# Altium schematic sheet Server PIMC.schdoc
size 537 x 318 mm
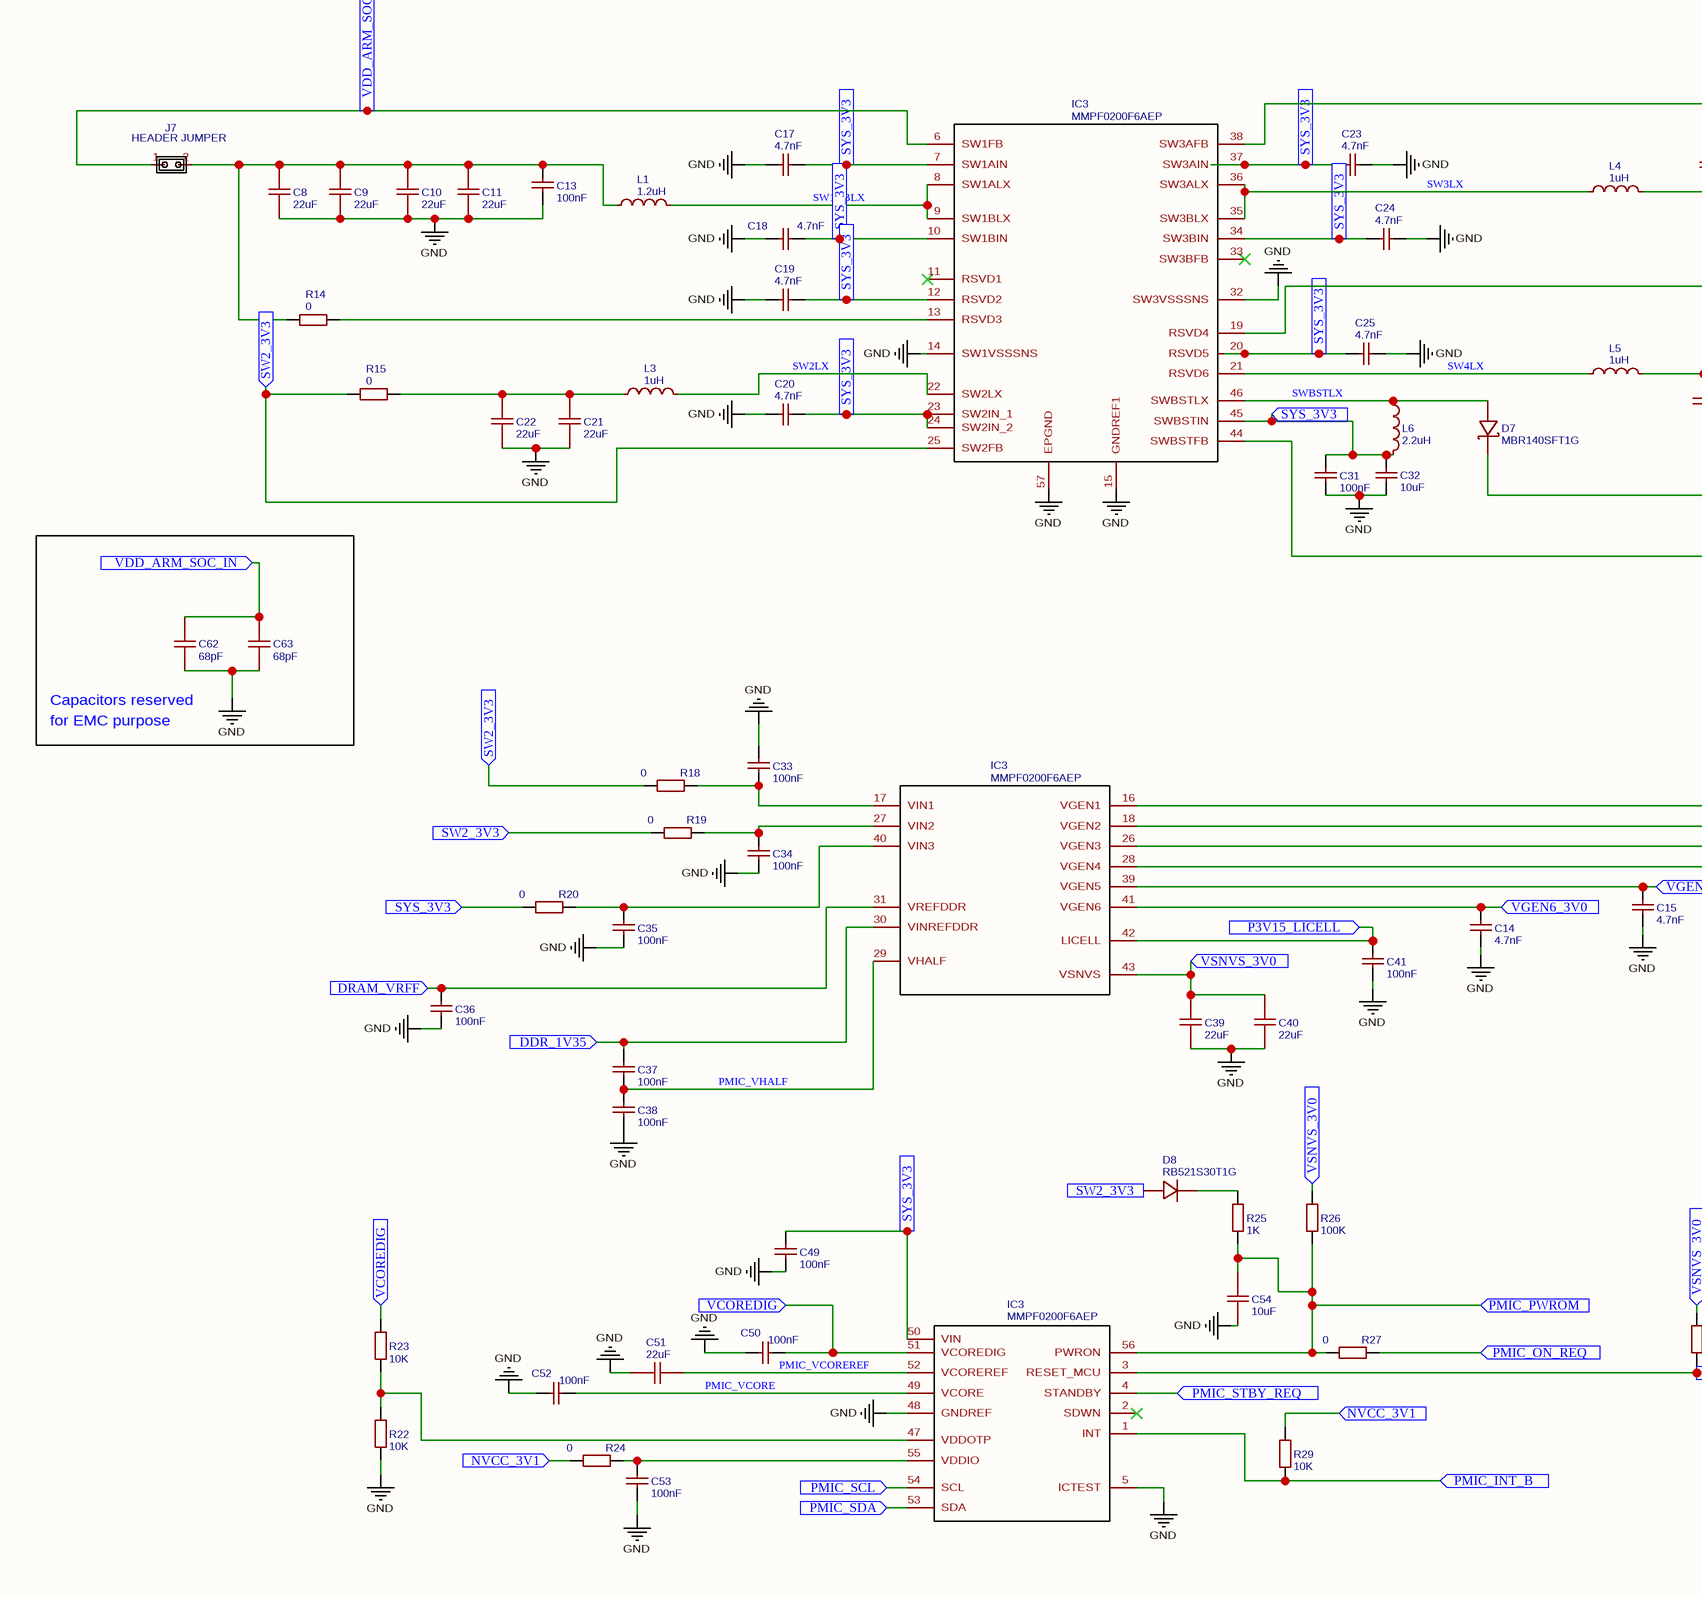
[diagram p0: Server PIMC.schdoc, left]
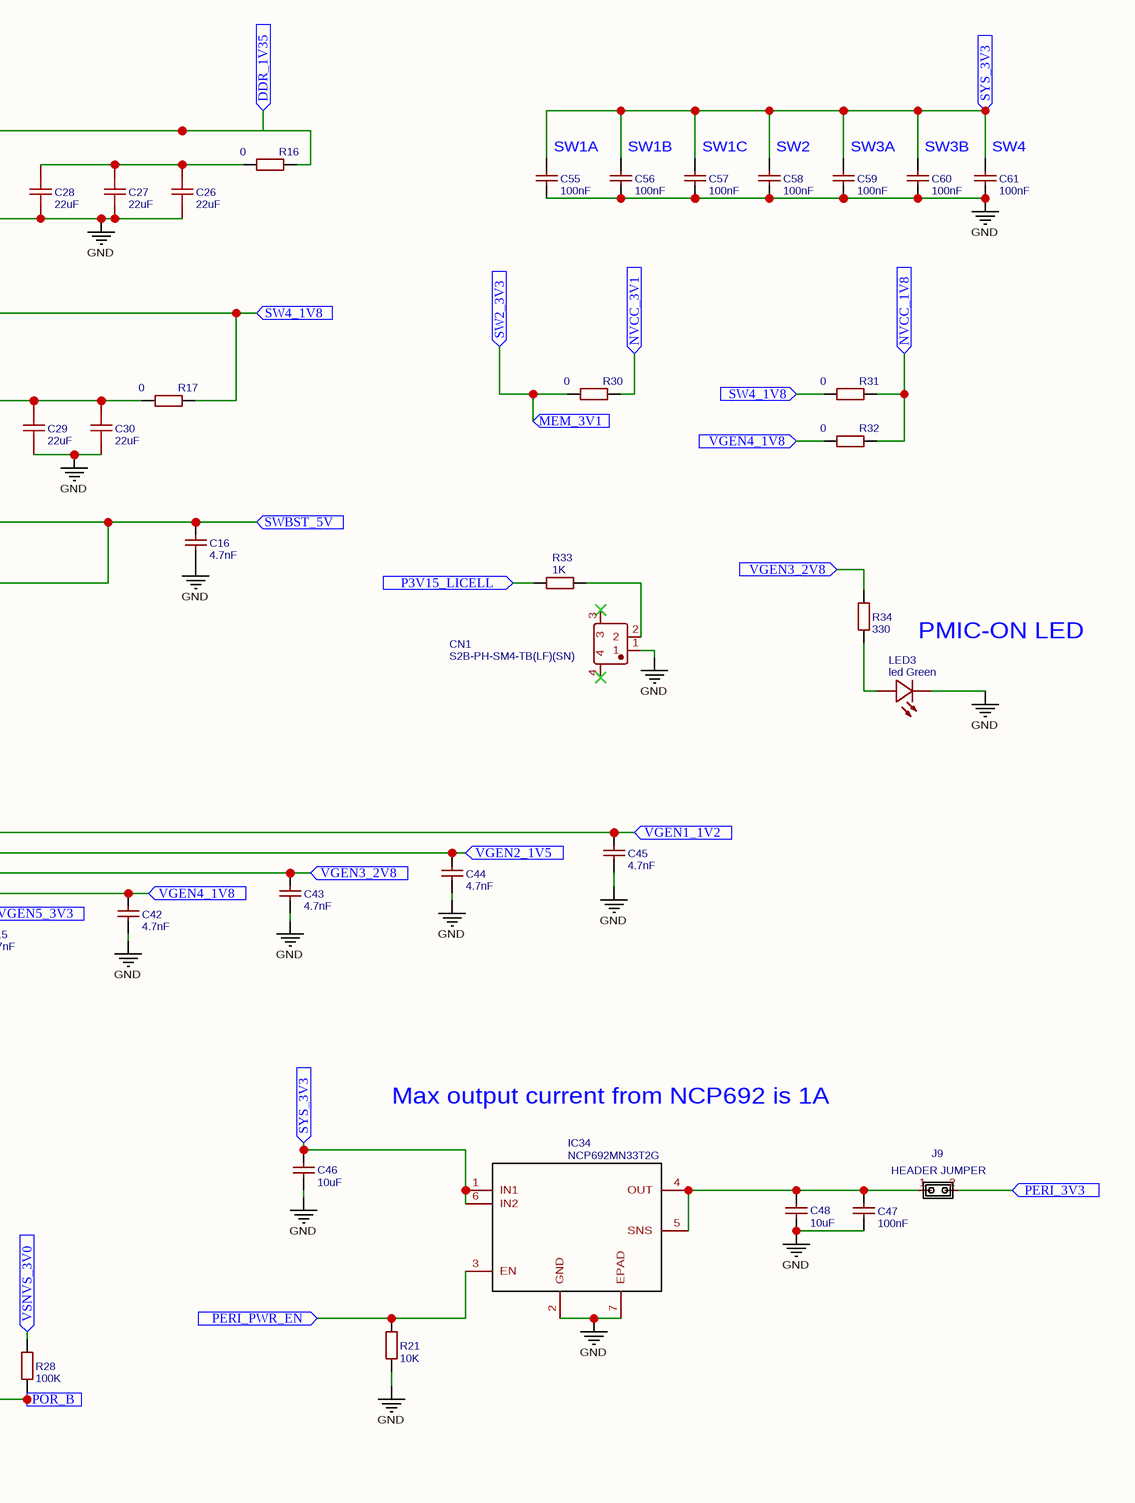
[diagram p1: Server PIMC.schdoc, right]

## Parts
(Parts that share a designator on the sheet are numbered #1, #2 ... from top to bottom, then left to right.)
C8  22uF  [C0603]
C9  22uF  [C0603]
C10  22uF  [C0603]
C11  22uF  [C0603]
C13  100nF  [C0805]
C14  4.7nF  [C0805]
C15  4.7nF  [C0805]
C16  4.7nF  [C0805]
C17  4.7nF  [C0805]
C18  4.7nF  [C0805]
C19  4.7nF  [C0805]
C20  4.7nF  [C0805]
C21  22uF  [C0603]
C22  22uF  [C0603]
C23  4.7nF  [C0805]
C24  4.7nF  [C0805]
C25  4.7nF  [C0805]
C26  22uF  [C0603]
C27  22uF  [C0603]
C28  22uF  [C0603]
C29  22uF  [C0603]
C30  22uF  [C0603]
C31  100nF  [C0805]
C32  10uF  [C0402]
C33  100nF  [C0805]
C34  100nF  [C0805]
C35  100nF  [C0805]
C36  100nF  [C0805]
C37  100nF  [C0805]
C38  100nF  [C0805]
C39  22uF  [C0603]
C40  22uF  [C0603]
C41  100nF  [C0805]
C42  4.7nF  [C0805]
C43  4.7nF  [C0805]
C44  4.7nF  [C0805]
C45  4.7nF  [C0805]
C46  10uF  [C0402]
C47  100nF  [C0805]
C48  10uF  [C0402]
C49  100nF  [C0805]
C50  100nF  [C0805]
C51  22uF  [C0603]
C52  100nF  [C0805]
C53  100nF  [C0805]
C54  10uF  [C0805]
C55  100nF  [C0805]
C56  100nF  [C0805]
C57  100nF  [C0805]
C58  100nF  [C0805]
C59  100nF  [C0805]
C60  100nF  [C0805]
C61  100nF  [C0805]
C62  68pF  [C0402]
C63  68pF  [C0402]
CN1  S2B-PH-SM4-TB(LF)(SN)  [CONN-SMD_P2.00_S2B-PH-SM4-TB(LF)(SN)]
D7  MBR140SFT1G  [SOD-123F_L2.8-W1.8-LS3.7-RD]
D8  RB521S30T1G  [SOD-523_L1.2-W0.8-LS1.6-RD]
IC3#1  MMPF0200F6AEP  [QFN50P800X800X100-57N]
IC3#2  MMPF0200F6AEP  [QFN50P800X800X100-57N]
IC3#3  MMPF0200F6AEP  [QFN50P800X800X100-57N]
IC34  NCP692MN33T2G  [SON95P300X300X100-7N]
J7  HEADER JUMPER  [HDR1X2]
J9  HEADER JUMPER  [HDR1X2]
L1  1.2uH  [IND-SMD_L4.4-W4.2]
L3  1uH  [IND-SMD_L11.5-W10.5_MWSA1004]
L4  1uH  [IND-SMD_L11.5-W10.5_MWSA1004]
L5  1uH  [IND-SMD_L11.5-W10.5_MWSA1004]
L6  2.2uH  [L0805]
LED3  led Green  [LED1206-RD]
R14  0  [R0402]
R15  0  [R0402]
R16  0  [R0402]
R17  0  [R0402]
R18  0  [R0402]
R19  0  [R0402]
R20  0  [R0402]
R21  10K  [R0805]
R22  10K  [R0805]
R23  10K  [R0805]
R24  0  [R0402]
R25  1K  [R0603]
R26  100K  [R0603]
R27  0  [R0402]
R28  100K  [R0603]
R29  10K  [R0805]
R30  0  [R0402]
R31  0  [R0402]
R32  0  [R0402]
R33  1K  [R0402]
R34  330  [R0805]

## Ports
DDR_1V35 (in), DRAM_VRFF (in), MEM_3V1 (in), NVCC_1V8 (in), NVCC_3V1 (in), P3V15_LICELL (in), PERI_3V3 (in), PERI_PWR_EN (in), PMIC_INT_B (in), PMIC_ON_REQ (in), PMIC_PWROM (in), PMIC_SCL (in), PMIC_SDA (in), PMIC_STBY_REQ (in), POR_B (in), SW2_3V3 (in), SW4_1V8 (in), SWBST_5V (in), SYS_3V3 (in), VCOREDIG (in), VDD_ARM_SOC_IN (in), VGEN1_1V2 (in), VGEN2_1V5 (in), VGEN3_2V8 (in), VGEN4_1V8 (in), VGEN5_3V3 (in), VGEN6_3V0 (in), VSNVS_3V0 (in)

## Nets
GND: C8.1 C9.1 C10.1 C11.1 C13.1 C14.1 C15.1 C16.1 C17.2 C18.2 C19.2 C20.2 C21.1 C22.1 C23.2 C24.2 C25.2 C26.1 C27.1 C28.1 C29.1 C30.1 C31.1 C32.1 C33.2 C34.1 C35.1 C36.1 C38.1 C39.1 C40.1 C41.1 C42.1 C43.1 C44.1 C45.1 C46.1 C47.1 C48.1 C49.1 C50.2 C51.2 C52.2 C53.2 C54.1 C55.1 C56.1 C57.1 C58.1 C59.1 C60.1 C61.1 C62.1 C63.1 CN1.1 IC3#1.14(SW1VSSSNS) IC3#1.15(GNDREF1) IC3#1.32(SW3VSSSNS) IC3#1.57(EPGND) IC3#3.5(ICTEST) IC3#3.48(GNDREF) IC34.2(GND) IC34.7(EPAD) L4.2 LED3.1(-) R21.1 R22.2
DDR_1V35: C37.2 IC3#1.38(SW3AFB) IC3#2.30(VINREFDDR) R16.2 ; port DDR_1V35
DRAM_VRFF: C36.2 IC3#2.31(VREFDDR) ; port DRAM_VRFF
MEM_3V1: D8.2(A) IC3#1.25(SW2FB) R15.1 R18.1 R19.1 R30.1 ; port SW2_3V3, port MEM_3V1
NVCC_1V8: R31.2 R32.2 ; port NVCC_1V8
NVCC_3V1: R24.1 R29.1 R30.2 ; port NVCC_3V1
P3V15_LICELL: C41.2 IC3#2.42(LICELL) R33.1 ; port P3V15_LICELL
PERI_3V3: J9.2 ; port PERI_3V3
PERI_PWR_EN: IC34.3(EN) R21.2 ; port PERI_PWR_EN
PMIC_INT_B: IC3#3.1(INT) R29.2 ; port PMIC_INT_B
PMIC_ON_REQ: R27.2 ; port PMIC_ON_REQ
PMIC_PWROM: C54.2 IC3#3.56(PWRON) R25.1 R26.1 R27.1 ; port PMIC_PWROM
PMIC_SCL: IC3#3.54(SCL) ; port PMIC_SCL
PMIC_SDA: IC3#3.53(SDA) ; port PMIC_SDA
PMIC_STBY_REQ: IC3#3.4(STANDBY) ; port PMIC_STBY_REQ
PMIC_VCORE: C52.1 IC3#3.49(VCORE)
PMIC_VCOREREF: C51.1 IC3#3.52(VCOREREF)
PMIC_VHALF: C37.1 C38.2 IC3#2.29(VHALF)
POR_B: IC3#3.3(RESET_MCU) R28.1 ; port POR_B
SW1ABLX: IC3#1.8(SW1ALX) IC3#1.9(SW1BLX) L1.2
SW2LX: IC3#1.22(SW2LX) L3.2
SW3LX: IC3#1.35(SW3BLX) IC3#1.36(SW3ALX) L4.1
SW4_1V8: IC3#1.19(RSVD4) R17.2 R31.1 ; port SW4_1V8
SW4LX: IC3#1.21(RSVD6) L5.1
SWBST_5V: C16.2 D7.1(K) IC3#1.44(SWBSTFB) ; port SWBST_5V
SWBSTLX: D7.2(A) IC3#1.46(SWBSTLX) L6.1
SYS_3V3: C17.1 C18.1 C19.1 C20.1 C23.1 C24.1 C25.1 C31.2 C32.2 C46.2 C49.2 C55.2 C56.2 C57.2 C58.2 C59.2 C60.2 C61.2 IC3#1.7(SW1AIN) IC3#1.10(SW1BIN) IC3#1.12(RSVD2) IC3#1.20(RSVD5) IC3#1.23(SW2IN_1) IC3#1.24(SW2IN_2) IC3#1.34(SW3BIN) IC3#1.37(SW3AIN) IC3#1.45(SWBSTIN) IC3#3.50(VIN) IC34.1(IN1) IC34.6(IN2) L6.2 R20.1 ; port SYS_3V3
VCOREDIG: C50.1 IC3#3.51(VCOREDIG) R23.2 ; port VCOREDIG
VDD_ARM_SOC_IN: C62.2 C63.2 IC3#1.6(SW1FB) J7.1 ; port VDD_ARM_SOC_IN
VGEN1_1V2: C45.2 IC3#2.16(VGEN1) ; port VGEN1_1V2
VGEN2_1V5: C44.2 IC3#2.18(VGEN2) ; port VGEN2_1V5
VGEN3_2V8: C43.2 IC3#2.26(VGEN3) R34.2 ; port VGEN3_2V8
VGEN4_1V8: C42.2 IC3#2.28(VGEN4) R32.1 ; port VGEN4_1V8
VGEN5_3V3: C15.2 IC3#2.39(VGEN5) ; port VGEN5_3V3
VGEN6_3V0: C14.2 IC3#2.41(VGEN6) ; port VGEN6_3V0
VSNVS_3V0: C39.2 C40.2 IC3#2.43(VSNVS) R26.2 R28.2 ; port VSNVS_3V0
NetC8_2: C8.2 C9.2 C10.2 C11.2 C13.2 J7.2 L1.1 R14.1
NetC21_2: C21.2 C22.2 L3.1 R15.2
NetC26_2: C26.2 C27.2 C28.2 R16.1
NetC29_2: C29.2 C30.2 L5.2 R17.1
NetC33_1: C33.1 IC3#2.17(VIN1) R18.2
NetC34_2: C34.2 IC3#2.27(VIN2) R19.2
NetC35_2: C35.2 IC3#2.40(VIN3) R20.2
NetC47_2: C47.2 C48.2 IC34.4(OUT) IC34.5(SNS) J9.1
NetC53_1: C53.1 IC3#3.55(VDDIO) R24.2
NetCN1_2: CN1.2 R33.2
NetD8_1: D8.1(C) R25.2
NetIC3#1_13: IC3#1.13(RSVD3) R14.2
NetIC3#3_47: IC3#3.47(VDDOTP) R22.1 R23.1
NetLED3_2: LED3.2(+) R34.1

Not connected (* = marked no-connect by the designer): CN1 3* 4*; IC3#1 11(RSVD1)* 33(SW3BFB)*; IC3#3 2(SDWN)*

## Notes on the sheet
- (near C55) SW1A
- (near C56) SW1B
- (near C57) SW1C
- (near C58) SW2
- (near C59) SW3A
- (near C60) SW3B
- (near C61) SW4
- PMIC-ON LED
- (near C62) Capacitors reserved
- for EMC purpose
- Max output current from NCP692 is 1A

## Library data of the parts
C8-C11 C21 C22 C26-C30 C39 C40 C51 = 22uF: BOM_Manufacturer: SAMSUNG; BOM_Manufacturer Part: CL10A226MP8NUNE; nameAlias: Capacitance; SMT Type: Extend; BOM_Supplier: LCSC; BOM_Supplier Part: C86295; BOM_LCSC Assembly: Yes; spicePre: C; spiceSymbolName: CL10A226MP8NUNE
C13 C31 C33-C38 C41 C47 C49 C50 C52 C53 C55-C61 = 100nF: BOM_Manufacturer Part: CC0805KRX7R9BB104; BOM_Manufacturer: YAGEO; nameAlias: Capacitance; SMT Type: Basic; BOM_Supplier: LCSC; BOM_LCSC Assembly: Yes; BOM_Supplier Part: C49678; spicePre: C; spiceSymbolName: CC0805KRX7R9BB104
C14-C20 C23-C25 C42-C45 = 4.7nF: BOM_Manufacturer: FH; BOM_Manufacturer Part: 0805B472K500NT; nameAlias: Capacitance; SMT Type: Basic; BOM_Supplier: LCSC; BOM_LCSC Assembly: Yes; BOM_Supplier Part: C1744; spicePre: C; spiceSymbolName: 0805B472K500NT
C32 C46 C48 = 10uF: BOM_Manufacturer Part: CL05A106MQ5NUNC; BOM_Manufacturer: SAMSUNG; nameAlias: Capacitance; SMT Type: Basic; BOM_Supplier: LCSC; BOM_LCSC Assembly: Yes; BOM_Supplier Part: C15525; spicePre: C; spiceSymbolName: CL05A106MQ5NUNC
C54 = 10uF: BOM_Manufacturer: FH; BOM_Manufacturer Part: 0805F106M160NT; nameAlias: Capacitance; SMT Type: Extend; BOM_Supplier: LCSC; BOM_Supplier Part: C90545; BOM_LCSC Assembly: Yes; spicePre: C; spiceSymbolName: 0805F106M160NT
C62 C63 = 68pF: BOM_Manufacturer: SAMSUNG; BOM_Manufacturer Part: CL05C680JB5NNNC; nameAlias: Capacitance; SMT Type: Basic; BOM_Supplier: LCSC; BOM_LCSC Assembly: Yes; BOM_Supplier Part: C14441; spicePre: C; spiceSymbolName: CL05C680JB5NNNC
CN1 = S2B-PH-SM4-TB(LF)(SN): BOM_Manufacturer: JST Sales America; Contributor: LCSC; BOM_Supplier: LCSC; BOM_Supplier Part: C295747; BOM_Manufacturer Part: S2B-PH-SM4-TB(LF)(SN); spicePre: C; spiceSymbolName: S2B-PH-SM4-TB(LF)(SN)
D7 = MBR140SFT1G: BOM_Manufacturer: ON; Contributor: LCSC; SMT Type: Extend; BOM_Supplier: LCSC; BOM_Manufacturer Part: MBR140SFT1G; BOM_Supplier Part: C43381; BOM_LCSC Assembly: Yes; spicePre: D; spiceSymbolName: MBR140SFT1G
D8 = RB521S30T1G: BOM_Manufacturer: ON Semicon; Contributor: LCSC; SMT Type: Extend; BOM_Supplier: LCSC; BOM_Supplier Part: C145179; BOM_Manufacturer Part: RB521S30T1G; BOM_LCSC Assembly: Yes; spicePre: D; spiceSymbolName: RB521S30T1G
IC3#1-IC3#3 = MMPF0200F6AEP: subpart_no: 1; Contributor: Ke'Ondrae_Mell; spicePre: I; spiceSymbolName: MMPF0200F6AEP
IC34 = NCP692MN33T2G: Contributor: Ke'Ondrae_Mell; spicePre: I; spiceSymbolName: NCP692MN33T2G
J7 J9 = HEADER JUMPER: Contributor: iinnovations; sourceId: 5aKIigQpn; timeStamp: 1467472897; spicePre: J; spiceSymbolName: HEADER JUMPER
L1 = 1.2uH: BOM_Manufacturer: Sunlord; BOM_Manufacturer Part: MWSA0402S-1R2MT; nameAlias: Inductance; Contributor: LCSC; SMT Type: Extend; BOM_Supplier: LCSC; BOM_Supplier Part: C408333; BOM_LCSC Assembly: Yes; spicePre: L; spiceSymbolName: MWSA0402S-1R2MT
L3-L5 = 1uH: BOM_Manufacturer: Sunlord; BOM_Manufacturer Part: MWSA1004-1R0MT; nameAlias: Inductance; Contributor: LCSC; SMT Type: Extend; BOM_Supplier: LCSC; BOM_Supplier Part: C151871; BOM_LCSC Assembly: Yes; spicePre: L; spiceSymbolName: MWSA1004-1R0MT
L6 = 2.2uH: BOM_Manufacturer Part: CMI201209U2R2KT; BOM_Manufacturer: FH; nameAlias: Inductance; SMT Type: Basic; BOM_Supplier: LCSC; BOM_LCSC Assembly: Yes; BOM_Supplier Part: C1043; spicePre: L; spiceSymbolName: CMI201209U2R2KT
LED3 = led Green: BOM_Manufacturer: KENTO; SMT Type: Extend; BOM_Supplier: LCSC; BOM_Manufacturer Part: led Green; image: //image.lceda.cn/szlcsc/C14641.jpg; BOM_Supplier Part: C14641; BOM_LCSC Assembly: Yes; spicePre: L; spiceSymbolName: led Green
R14-R20 R24 R27 R30-R32 = 0: BOM_Manufacturer: KOA; BOM_Manufacturer Part: RK73Z1ETTP; nameAlias: Resistance (Ohms); BOM_Supplier: LCSC; BOM_Supplier Part: C131359; spicePre: R; spiceSymbolName: RK73Z1ETTP
R21-R23 R29 = 10K: BOM_Manufacturer: UniOhm; BOM_Manufacturer Part: 0805W8F1002T5E; nameAlias: Resistance (Ohms); SMT Type: Basic; BOM_Supplier: LCSC; BOM_LCSC Assembly: Yes; BOM_Supplier Part: C17414; spicePre: R; spiceSymbolName: 0805W8F1002T5E
R25 = 1K: BOM_Manufacturer: UniOhm; BOM_Manufacturer Part: 0603WAF1001T5E; nameAlias: Resistance (Ohms); SMT Type: Basic; BOM_Supplier: LCSC; BOM_LCSC Assembly: Yes; BOM_Supplier Part: C21190; spicePre: R; spiceSymbolName: 0603WAF1001T5E
R26 R28 = 100K: BOM_Manufacturer: UniOhm; BOM_Manufacturer Part: 0603WAF1003T5E; nameAlias: Resistance (Ohms); SMT Type: Basic; BOM_Supplier: LCSC; BOM_LCSC Assembly: Yes; BOM_Supplier Part: C25803; spicePre: R; spiceSymbolName: 0603WAF1003T5E
R33 = 1K: BOM_Manufacturer: UniOhm; BOM_Manufacturer Part: 0402WGF1001TCE; nameAlias: Resistance (Ohms); SMT Type: Basic; BOM_Supplier: LCSC; BOM_LCSC Assembly: Yes; BOM_Supplier Part: C11702; spicePre: R; spiceSymbolName: 0402WGF1001TCE
R34 = 330: BOM_Manufacturer: UniOhm; BOM_Manufacturer Part: TC0525B3300T5E; nameAlias: Resistance (Ohms); SMT Type: Extend; BOM_Supplier: LCSC; BOM_Supplier Part: C44794; BOM_LCSC Assembly: Yes; spicePre: R; spiceSymbolName: TC0525B3300T5E